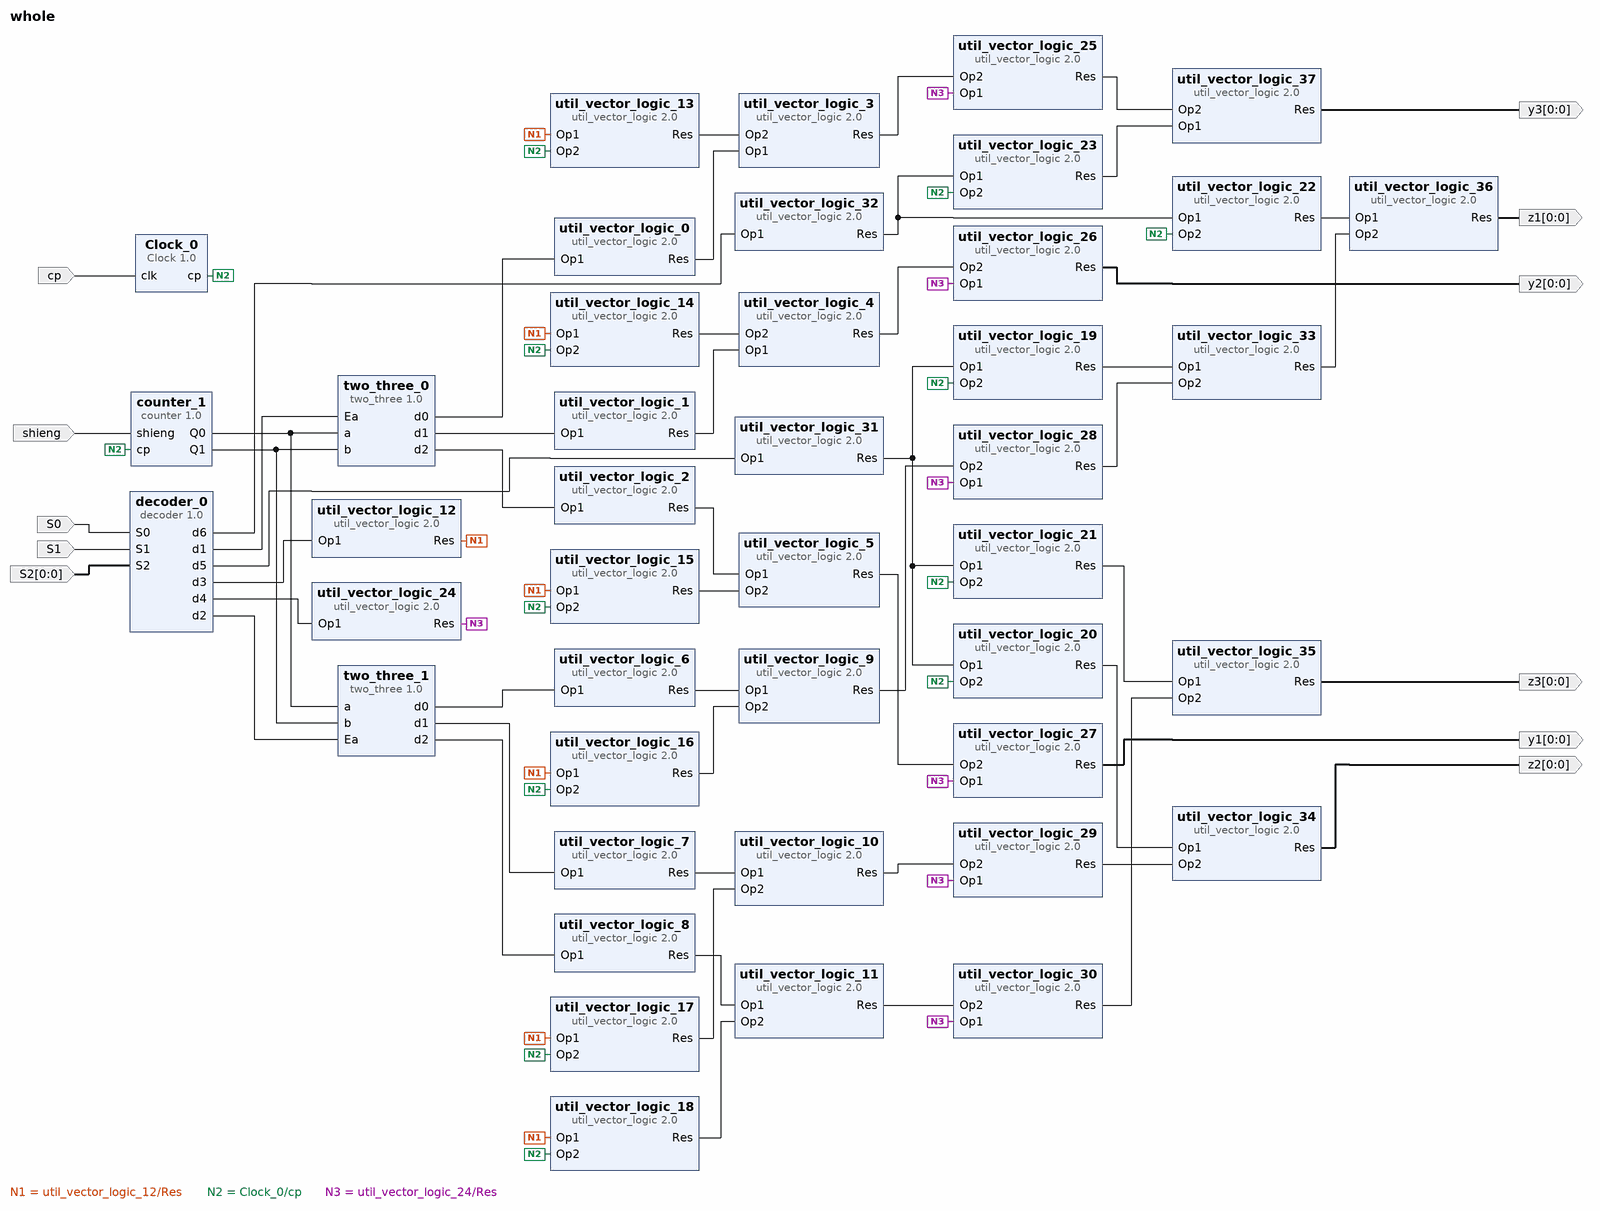
[diagram p0: block diagram of the top level]
# Vivado block design whole, xc7a35tcsg324-3, Vivado 2018.1
create_bd_design whole

create_bd_port -dir I S0
create_bd_port -dir I S1
create_bd_port -dir I shieng
create_bd_port -dir I -type clk cp
set_property -dict {CONFIG.FREQ_HZ 5} [get_bd_ports cp]
create_bd_port -dir I -from 0 -to 0 S2
create_bd_port -dir O -from 0 -to 0 y2
create_bd_port -dir O -from 0 -to 0 y1
create_bd_port -dir O -from 0 -to 0 z2
create_bd_port -dir O -from 0 -to 0 z3
create_bd_port -dir O -from 0 -to 0 z1
create_bd_port -dir O -from 0 -to 0 y3

create_bd_cell -type ip -vlnv xilinx.com:ip:util_vector_logic:2.0 util_vector_logic_0
set_property -dict {CONFIG.C_SIZE 1 CONFIG.C_OPERATION not} [get_bd_cells util_vector_logic_0]
create_bd_cell -type ip -vlnv xilinx.com:ip:util_vector_logic:2.0 util_vector_logic_1
set_property -dict {CONFIG.C_SIZE 1 CONFIG.C_OPERATION not} [get_bd_cells util_vector_logic_1]
create_bd_cell -type ip -vlnv xilinx.com:ip:util_vector_logic:2.0 util_vector_logic_2
set_property -dict {CONFIG.C_SIZE 1 CONFIG.C_OPERATION not} [get_bd_cells util_vector_logic_2]
create_bd_cell -type ip -vlnv xilinx.com:ip:util_vector_logic:2.0 util_vector_logic_3
set_property -dict {CONFIG.C_SIZE 1 CONFIG.C_OPERATION or} [get_bd_cells util_vector_logic_3]
create_bd_cell -type ip -vlnv xilinx.com:ip:util_vector_logic:2.0 util_vector_logic_13
set_property -dict {CONFIG.C_SIZE 1 CONFIG.C_OPERATION and} [get_bd_cells util_vector_logic_13]
create_bd_cell -type ip -vlnv xilinx.com:ip:util_vector_logic:2.0 util_vector_logic_14
set_property -dict {CONFIG.C_SIZE 1 CONFIG.C_OPERATION and} [get_bd_cells util_vector_logic_14]
create_bd_cell -type ip -vlnv xilinx.com:ip:util_vector_logic:2.0 util_vector_logic_15
set_property -dict {CONFIG.C_SIZE 1 CONFIG.C_OPERATION and} [get_bd_cells util_vector_logic_15]
create_bd_cell -type ip -vlnv xilinx.com:ip:util_vector_logic:2.0 util_vector_logic_16
set_property -dict {CONFIG.C_SIZE 1 CONFIG.C_OPERATION and} [get_bd_cells util_vector_logic_16]
create_bd_cell -type ip -vlnv xilinx.com:ip:util_vector_logic:2.0 util_vector_logic_17
set_property -dict {CONFIG.C_SIZE 1 CONFIG.C_OPERATION and} [get_bd_cells util_vector_logic_17]
create_bd_cell -type ip -vlnv xilinx.com:ip:util_vector_logic:2.0 util_vector_logic_18
set_property -dict {CONFIG.C_SIZE 1 CONFIG.C_OPERATION and} [get_bd_cells util_vector_logic_18]
create_bd_cell -type ip -vlnv xilinx.com:ip:util_vector_logic:2.0 util_vector_logic_6
set_property -dict {CONFIG.C_SIZE 1 CONFIG.C_OPERATION not} [get_bd_cells util_vector_logic_6]
create_bd_cell -type ip -vlnv xilinx.com:ip:util_vector_logic:2.0 util_vector_logic_4
set_property -dict {CONFIG.C_SIZE 1 CONFIG.C_OPERATION or} [get_bd_cells util_vector_logic_4]
create_bd_cell -type ip -vlnv xilinx.com:ip:util_vector_logic:2.0 util_vector_logic_5
set_property -dict {CONFIG.C_SIZE 1 CONFIG.C_OPERATION or} [get_bd_cells util_vector_logic_5]
create_bd_cell -type ip -vlnv xilinx.com:ip:util_vector_logic:2.0 util_vector_logic_9
set_property -dict {CONFIG.C_SIZE 1 CONFIG.C_OPERATION or} [get_bd_cells util_vector_logic_9]
create_bd_cell -type ip -vlnv xilinx.com:ip:util_vector_logic:2.0 util_vector_logic_10
set_property -dict {CONFIG.C_SIZE 1 CONFIG.C_OPERATION or} [get_bd_cells util_vector_logic_10]
create_bd_cell -type ip -vlnv xilinx.com:ip:util_vector_logic:2.0 util_vector_logic_11
set_property -dict {CONFIG.C_SIZE 1 CONFIG.C_OPERATION or} [get_bd_cells util_vector_logic_11]
create_bd_cell -type ip -vlnv xilinx.com:ip:util_vector_logic:2.0 util_vector_logic_7
set_property -dict {CONFIG.C_SIZE 1 CONFIG.C_OPERATION not} [get_bd_cells util_vector_logic_7]
create_bd_cell -type ip -vlnv xilinx.com:ip:util_vector_logic:2.0 util_vector_logic_8
set_property -dict {CONFIG.C_SIZE 1 CONFIG.C_OPERATION not} [get_bd_cells util_vector_logic_8]
create_bd_cell -type ip -vlnv xilinx.com:ip:util_vector_logic:2.0 util_vector_logic_12
set_property -dict {CONFIG.C_SIZE 1 CONFIG.C_OPERATION not} [get_bd_cells util_vector_logic_12]
create_bd_cell -type ip -vlnv xilinx.com:user:Clock:1.0 Clock_0
create_bd_cell -type ip -vlnv xilinx.com:user:decoder:1.0 decoder_0
create_bd_cell -type ip -vlnv xilinx.com:user:two_three:1.0 two_three_0
create_bd_cell -type ip -vlnv xilinx.com:user:two_three:1.0 two_three_1
create_bd_cell -type ip -vlnv xilinx.com:user:counter:1.0 counter_1
create_bd_cell -type ip -vlnv xilinx.com:ip:util_vector_logic:2.0 util_vector_logic_24
set_property -dict {CONFIG.C_SIZE 1 CONFIG.C_OPERATION not} [get_bd_cells util_vector_logic_24]
create_bd_cell -type ip -vlnv xilinx.com:ip:util_vector_logic:2.0 util_vector_logic_25
set_property -dict {CONFIG.C_SIZE 1 CONFIG.C_OPERATION or} [get_bd_cells util_vector_logic_25]
create_bd_cell -type ip -vlnv xilinx.com:ip:util_vector_logic:2.0 util_vector_logic_26
set_property -dict {CONFIG.C_SIZE 1 CONFIG.C_OPERATION or} [get_bd_cells util_vector_logic_26]
create_bd_cell -type ip -vlnv xilinx.com:ip:util_vector_logic:2.0 util_vector_logic_27
set_property -dict {CONFIG.C_SIZE 1 CONFIG.C_OPERATION or} [get_bd_cells util_vector_logic_27]
create_bd_cell -type ip -vlnv xilinx.com:ip:util_vector_logic:2.0 util_vector_logic_28
set_property -dict {CONFIG.C_SIZE 1 CONFIG.C_OPERATION or} [get_bd_cells util_vector_logic_28]
create_bd_cell -type ip -vlnv xilinx.com:ip:util_vector_logic:2.0 util_vector_logic_29
set_property -dict {CONFIG.C_SIZE 1 CONFIG.C_OPERATION or} [get_bd_cells util_vector_logic_29]
create_bd_cell -type ip -vlnv xilinx.com:ip:util_vector_logic:2.0 util_vector_logic_30
set_property -dict {CONFIG.C_SIZE 1 CONFIG.C_OPERATION or} [get_bd_cells util_vector_logic_30]
create_bd_cell -type ip -vlnv xilinx.com:ip:util_vector_logic:2.0 util_vector_logic_31
set_property -dict {CONFIG.C_SIZE 1 CONFIG.C_OPERATION not} [get_bd_cells util_vector_logic_31]
create_bd_cell -type ip -vlnv xilinx.com:ip:util_vector_logic:2.0 util_vector_logic_19
set_property -dict {CONFIG.C_SIZE 1 CONFIG.C_OPERATION and} [get_bd_cells util_vector_logic_19]
create_bd_cell -type ip -vlnv xilinx.com:ip:util_vector_logic:2.0 util_vector_logic_20
set_property -dict {CONFIG.C_SIZE 1 CONFIG.C_OPERATION and} [get_bd_cells util_vector_logic_20]
create_bd_cell -type ip -vlnv xilinx.com:ip:util_vector_logic:2.0 util_vector_logic_21
set_property -dict {CONFIG.C_SIZE 1 CONFIG.C_OPERATION and} [get_bd_cells util_vector_logic_21]
create_bd_cell -type ip -vlnv xilinx.com:ip:util_vector_logic:2.0 util_vector_logic_33
set_property -dict {CONFIG.C_SIZE 1 CONFIG.C_OPERATION or} [get_bd_cells util_vector_logic_33]
create_bd_cell -type ip -vlnv xilinx.com:ip:util_vector_logic:2.0 util_vector_logic_34
set_property -dict {CONFIG.C_SIZE 1 CONFIG.C_OPERATION or} [get_bd_cells util_vector_logic_34]
create_bd_cell -type ip -vlnv xilinx.com:ip:util_vector_logic:2.0 util_vector_logic_35
set_property -dict {CONFIG.C_SIZE 1 CONFIG.C_OPERATION or} [get_bd_cells util_vector_logic_35]
create_bd_cell -type ip -vlnv xilinx.com:ip:util_vector_logic:2.0 util_vector_logic_32
set_property -dict {CONFIG.C_SIZE 1 CONFIG.C_OPERATION not} [get_bd_cells util_vector_logic_32]
create_bd_cell -type ip -vlnv xilinx.com:ip:util_vector_logic:2.0 util_vector_logic_22
set_property -dict {CONFIG.C_SIZE 1 CONFIG.C_OPERATION and} [get_bd_cells util_vector_logic_22]
create_bd_cell -type ip -vlnv xilinx.com:ip:util_vector_logic:2.0 util_vector_logic_23
set_property -dict {CONFIG.C_SIZE 1 CONFIG.C_OPERATION and} [get_bd_cells util_vector_logic_23]
create_bd_cell -type ip -vlnv xilinx.com:ip:util_vector_logic:2.0 util_vector_logic_36
set_property -dict {CONFIG.C_SIZE 1 CONFIG.C_OPERATION or} [get_bd_cells util_vector_logic_36]
create_bd_cell -type ip -vlnv xilinx.com:ip:util_vector_logic:2.0 util_vector_logic_37
set_property -dict {CONFIG.C_SIZE 1 CONFIG.C_OPERATION or} [get_bd_cells util_vector_logic_37]

# ---- connections ----

connect_bd_net [get_bd_pins util_vector_logic_0/Res] [get_bd_pins util_vector_logic_3/Op1]
connect_bd_net [get_bd_pins util_vector_logic_1/Res] [get_bd_pins util_vector_logic_4/Op1]
connect_bd_net [get_bd_pins util_vector_logic_2/Res] [get_bd_pins util_vector_logic_5/Op1]
connect_bd_net [get_bd_pins util_vector_logic_6/Res] [get_bd_pins util_vector_logic_9/Op1]
connect_bd_net [get_bd_pins util_vector_logic_7/Res] [get_bd_pins util_vector_logic_10/Op1]
connect_bd_net [get_bd_pins util_vector_logic_8/Res] [get_bd_pins util_vector_logic_11/Op1]
connect_bd_net [get_bd_pins util_vector_logic_12/Res] \
  [get_bd_pins util_vector_logic_13/Op1] [get_bd_pins util_vector_logic_14/Op1] [get_bd_pins util_vector_logic_15/Op1] \
  [get_bd_pins util_vector_logic_16/Op1] [get_bd_pins util_vector_logic_17/Op1] [get_bd_pins util_vector_logic_18/Op1]
connect_bd_net [get_bd_pins util_vector_logic_13/Res] [get_bd_pins util_vector_logic_3/Op2]
connect_bd_net [get_bd_pins util_vector_logic_14/Res] [get_bd_pins util_vector_logic_4/Op2]
connect_bd_net [get_bd_pins util_vector_logic_15/Res] [get_bd_pins util_vector_logic_5/Op2]
connect_bd_net [get_bd_pins util_vector_logic_16/Res] [get_bd_pins util_vector_logic_9/Op2]
connect_bd_net [get_bd_pins util_vector_logic_17/Res] [get_bd_pins util_vector_logic_10/Op2]
connect_bd_net [get_bd_pins util_vector_logic_18/Res] [get_bd_pins util_vector_logic_11/Op2]
connect_bd_net -net S0_0_1 [get_bd_ports S0] [get_bd_pins decoder_0/S0]
connect_bd_net -net S1_0_1 [get_bd_ports S1] [get_bd_pins decoder_0/S1]
connect_bd_net -net shieng_0_1 [get_bd_ports shieng] [get_bd_pins counter_1/shieng]
connect_bd_net [get_bd_ports cp] [get_bd_pins Clock_0/clk]
connect_bd_net -net fp_even_0_clk_out [get_bd_pins Clock_0/cp] \
  [get_bd_pins util_vector_logic_13/Op2] [get_bd_pins util_vector_logic_14/Op2] [get_bd_pins util_vector_logic_15/Op2] \
  [get_bd_pins util_vector_logic_16/Op2] [get_bd_pins util_vector_logic_17/Op2] [get_bd_pins util_vector_logic_18/Op2] \
  [get_bd_pins counter_1/cp] [get_bd_pins util_vector_logic_19/Op2] [get_bd_pins util_vector_logic_20/Op2] \
  [get_bd_pins util_vector_logic_21/Op2] [get_bd_pins util_vector_logic_22/Op2] [get_bd_pins util_vector_logic_23/Op2]
connect_bd_net -net Ea_1 [get_bd_ports S2] [get_bd_pins decoder_0/S2]
connect_bd_net [get_bd_pins two_three_0/d0] [get_bd_pins util_vector_logic_0/Op1]
connect_bd_net [get_bd_pins two_three_0/d1] [get_bd_pins util_vector_logic_1/Op1]
connect_bd_net [get_bd_pins two_three_0/d2] [get_bd_pins util_vector_logic_2/Op1]
connect_bd_net [get_bd_pins two_three_1/d0] [get_bd_pins util_vector_logic_6/Op1]
connect_bd_net [get_bd_pins two_three_1/d1] [get_bd_pins util_vector_logic_7/Op1]
connect_bd_net [get_bd_pins two_three_1/d2] [get_bd_pins util_vector_logic_8/Op1]
connect_bd_net [get_bd_pins decoder_0/d1] [get_bd_pins two_three_0/Ea]
connect_bd_net [get_bd_pins decoder_0/d2] [get_bd_pins two_three_1/Ea]
connect_bd_net [get_bd_pins decoder_0/d3] [get_bd_pins util_vector_logic_12/Op1]
connect_bd_net [get_bd_pins counter_1/Q0] [get_bd_pins two_three_0/a] [get_bd_pins two_three_1/a]
connect_bd_net [get_bd_pins counter_1/Q1] [get_bd_pins two_three_1/b] [get_bd_pins two_three_0/b]
connect_bd_net [get_bd_pins decoder_0/d4] [get_bd_pins util_vector_logic_24/Op1]
connect_bd_net [get_bd_pins util_vector_logic_24/Res] \
  [get_bd_pins util_vector_logic_25/Op1] [get_bd_pins util_vector_logic_26/Op1] [get_bd_pins util_vector_logic_27/Op1] \
  [get_bd_pins util_vector_logic_28/Op1] [get_bd_pins util_vector_logic_29/Op1] [get_bd_pins util_vector_logic_30/Op1]
connect_bd_net [get_bd_pins util_vector_logic_3/Res] [get_bd_pins util_vector_logic_25/Op2]
connect_bd_net [get_bd_pins util_vector_logic_4/Res] [get_bd_pins util_vector_logic_26/Op2]
connect_bd_net [get_bd_pins util_vector_logic_26/Res] [get_bd_ports y2]
connect_bd_net [get_bd_pins util_vector_logic_5/Res] [get_bd_pins util_vector_logic_27/Op2]
connect_bd_net [get_bd_pins util_vector_logic_27/Res] [get_bd_ports y1]
connect_bd_net [get_bd_pins util_vector_logic_9/Res] [get_bd_pins util_vector_logic_28/Op2]
connect_bd_net [get_bd_pins util_vector_logic_10/Res] [get_bd_pins util_vector_logic_29/Op2]
connect_bd_net [get_bd_pins util_vector_logic_11/Res] [get_bd_pins util_vector_logic_30/Op2]
connect_bd_net [get_bd_pins decoder_0/d5] [get_bd_pins util_vector_logic_31/Op1]
connect_bd_net [get_bd_pins util_vector_logic_31/Res] \
  [get_bd_pins util_vector_logic_19/Op1] [get_bd_pins util_vector_logic_20/Op1] [get_bd_pins util_vector_logic_21/Op1]
connect_bd_net [get_bd_pins util_vector_logic_19/Res] [get_bd_pins util_vector_logic_33/Op1]
connect_bd_net [get_bd_pins util_vector_logic_28/Res] [get_bd_pins util_vector_logic_33/Op2]
connect_bd_net [get_bd_pins util_vector_logic_20/Res] [get_bd_pins util_vector_logic_34/Op1]
connect_bd_net [get_bd_pins util_vector_logic_29/Res] [get_bd_pins util_vector_logic_34/Op2]
connect_bd_net [get_bd_pins util_vector_logic_34/Res] [get_bd_ports z2]
connect_bd_net [get_bd_pins util_vector_logic_30/Res] [get_bd_pins util_vector_logic_35/Op2]
connect_bd_net [get_bd_pins util_vector_logic_21/Res] [get_bd_pins util_vector_logic_35/Op1]
connect_bd_net [get_bd_pins util_vector_logic_35/Res] [get_bd_ports z3]
connect_bd_net [get_bd_pins decoder_0/d6] [get_bd_pins util_vector_logic_32/Op1]
connect_bd_net [get_bd_pins util_vector_logic_32/Res] [get_bd_pins util_vector_logic_22/Op1] [get_bd_pins util_vector_logic_23/Op1]
connect_bd_net [get_bd_pins util_vector_logic_22/Res] [get_bd_pins util_vector_logic_36/Op1]
connect_bd_net [get_bd_pins util_vector_logic_23/Res] [get_bd_pins util_vector_logic_37/Op1]
connect_bd_net [get_bd_pins util_vector_logic_33/Res] [get_bd_pins util_vector_logic_36/Op2]
connect_bd_net [get_bd_pins util_vector_logic_36/Res] [get_bd_ports z1]
connect_bd_net [get_bd_pins util_vector_logic_25/Res] [get_bd_pins util_vector_logic_37/Op2]
connect_bd_net [get_bd_pins util_vector_logic_37/Res] [get_bd_ports y3]

validate_bd_design
save_bd_design
